# EAGLE design i2c_keypad (EAGLE 5.10)
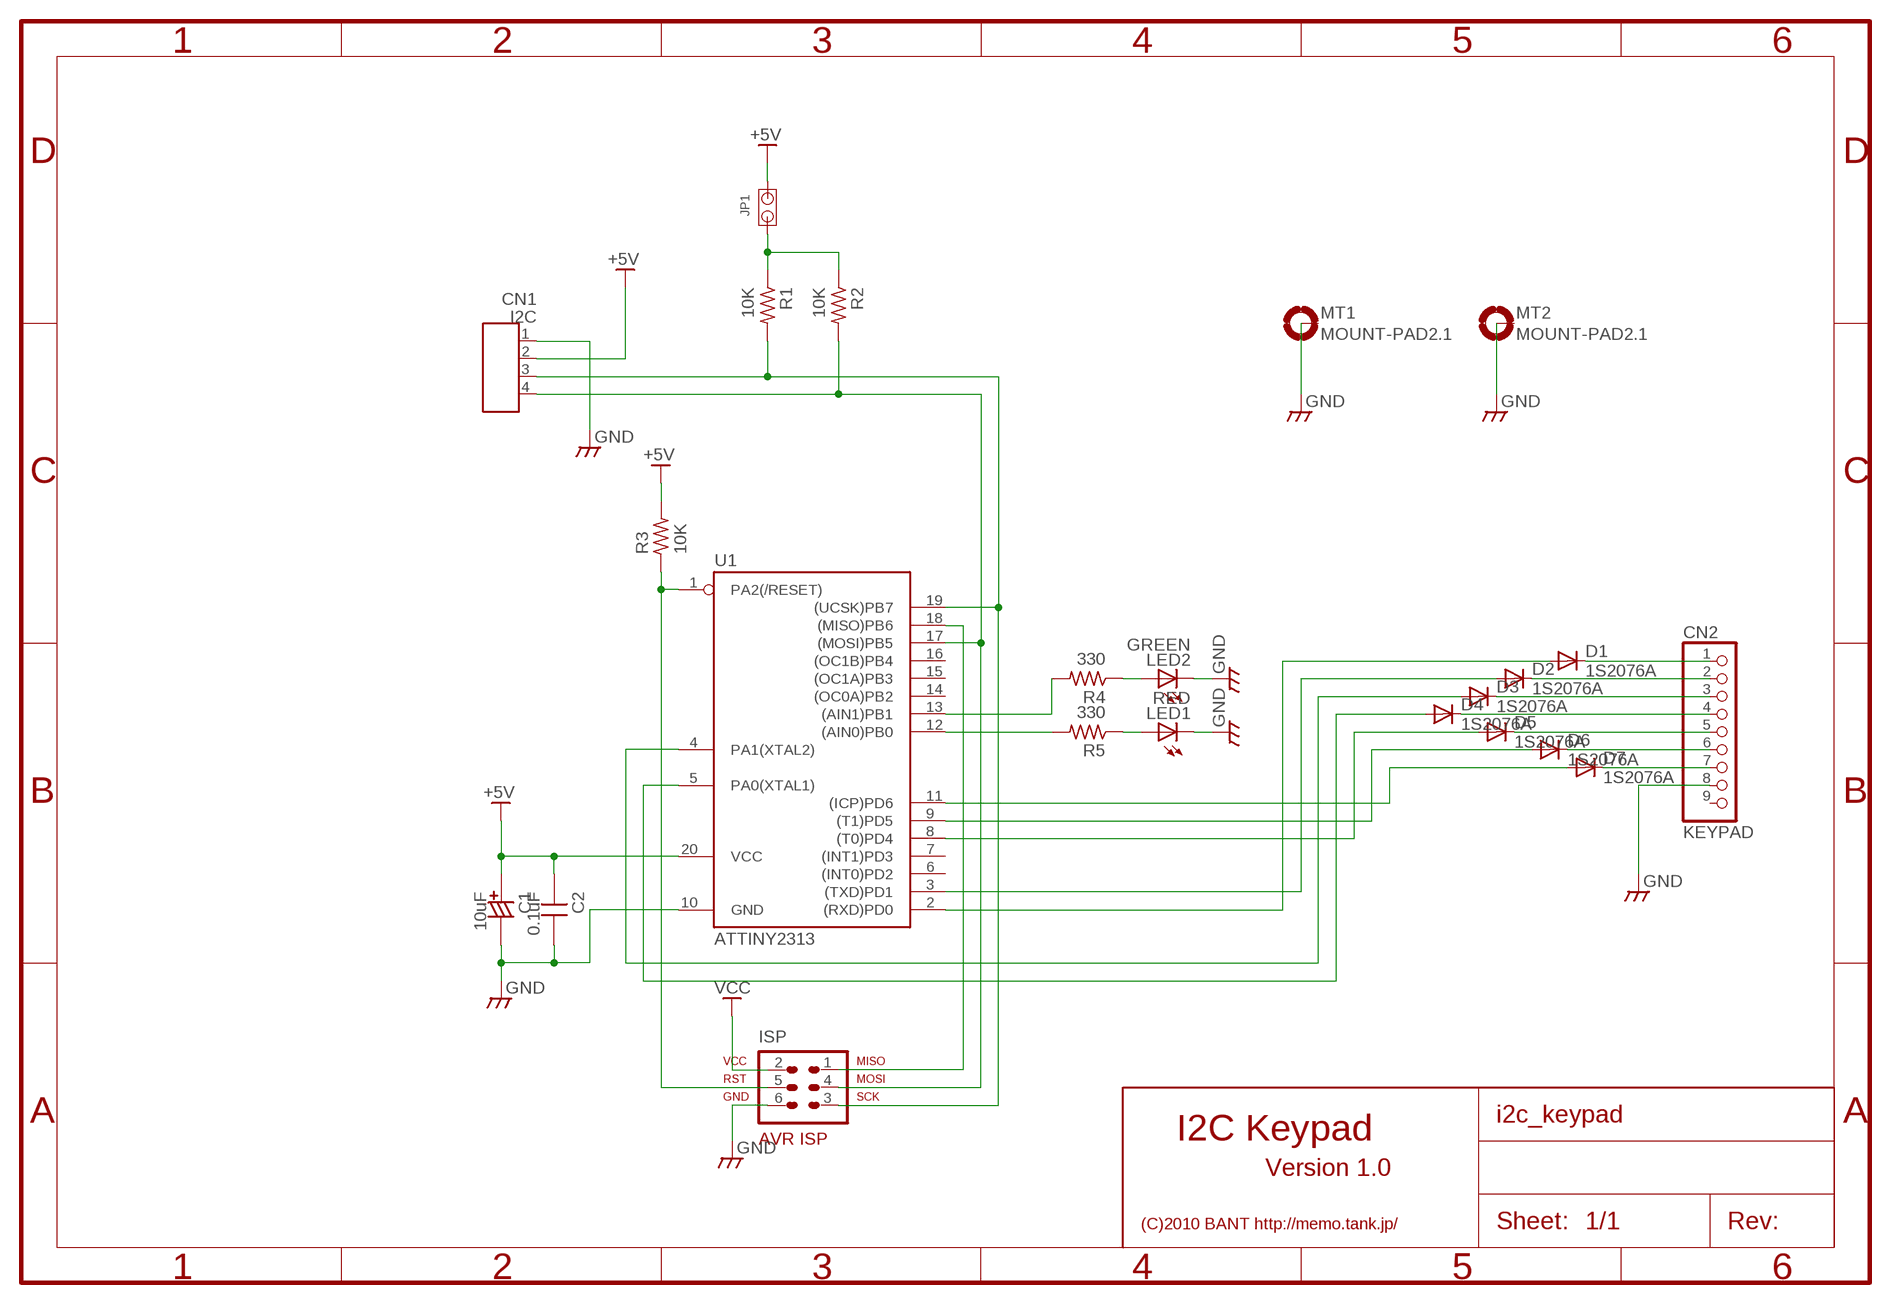
[diagram p0: schematic, sheet 1]

## Parts
C1  10uF  CCAP_4  [CCAP_4]
C2  0.1uF  CAPDIP_2  [CAP_DIP_2]
CN1  I2C  CON_4P  [CON_HRS_DIP_4]
CN2  KEYPAD  PINHD-1X09_2.54  [1X09]
D1  1S2076A  AA112  [DO07]
D2  1S2076A  AA112  [DO07]
D3  1S2076A  AA112  [DO07]
D4  1S2076A  AA112  [DO07]
D5  1S2076A  AA112  [DO07]
D6  1S2076A  AA112  [DO07]
D7  1S2076A  AA112  [DO07]
ISP  AVR-ISP-6NS  [2X3-NS]
JP1  JUMPER_2P  [CON_PINHEAD_2]
LED1  RED  LED3MM  [LED3MM]
LED2  GREEN  LED3MM  [LED3MM]
MT1  MOUNT-PAD2.1  [PAD-2.1]
MT2  MOUNT-PAD2.1  [PAD-2.1]
R1  10K  R0.125W_3P  [R_0.125W_3]
R2  10K  R0.125W_3P  [R_0.125W_3]
R3  10K  R0.125W_3P  [R_0.125W_3]
R4  330  R0.125W_3P  [R_0.125W_3]
R5  330  R0.125W_3P  [R_0.125W_3]
U1  ATTINY2313  TINY2313-*P*  [DIL20]

## Nets
GND: C1.- C2.2 CN1.1 CN2.8 ISP.6 LED1.K(C) LED2.K(C) MT1.B2,1(MOUNT) MT2.B2,1(MOUNT) U1.10(GND)
N$1: D1.A U1.2((RXD)PD0)
N$2: D2.A U1.3((TXD)PD1)
N$3: D3.A U1.4(PA1(XTAL2))
N$4: D4.A U1.5(PA0(XTAL1))
N$5: D5.A U1.8((T0)PD4)
N$6: D6.A U1.9((T1)PD5)
N$7: D7.A U1.11((ICP)PD6)
N$8: CN2.1 D1.C
N$9: CN2.2 D2.C
N$10: CN2.3 D3.C
N$11: CN2.4 D4.C
N$12: CN2.5 D5.C
N$13: CN2.6 D6.C
N$14: CN2.7 D7.C
N$15: CN1.4 ISP.4 R2.2 U1.17((MOSI)PB5)
N$16: ISP.5 R3.1 U1.1(PA2(/RESET))
N$17: R4.2 U1.13((AIN1)PB1)
N$18: ISP.1 U1.18((MISO)PB6)
N$19: R5.2 U1.12((AIN0)PB0)
N$20: LED1.A R5.1
N$21: JP1.1 R1.1 R2.1
N$22: LED2.A R4.1
N$23: CN1.3 ISP.3 R1.2 U1.19((UCSK)PB7)
VCC: C1.+ C2.1 CN1.2 ISP.2 JP1.2 R3.2 U1.20(VCC) ; supply symbol labelled +5V
Unconnected: CN2.9 U1.6((INT0)PD2) U1.7((INT1)PD3) U1.14((OC0A)PB2) U1.15((OC1A)PB3) U1.16((OC1B)PB4)

## Notes on the sheet
- I2C Keypad
- Version 1.0
- (C)2010 BANT http://memo.tank.jp/

## Library data of the parts
C1 = MyLib:CCAP: Polar capacitor
C2 = MyLib:CAP: Non polar capacitor
CN1 = MyLib:CON_4P: 4P Molex Connector
CN2 = pinheader:PINHD-1X09: PIN HEADER
D1-D7 = diode:AA112: DIODE germanium
ISP = atmel:AVR-ISP-6: AVR ISP-6 Serial Programming Header
JP1 = MyLib:JUMPER_2P: 2P Jumper Switch
LED1 LED2 = led:LED: LED OSRAM: - CHIPLED LG R971, LG N971, LY N971, LG Q971, LY Q971, LO R971, LY R971 LH N974, LH R974 LS Q976, LO Q976, LY Q976 LO Q996 - Hyper CHIPLED LW Q18S LB Q993, LB Q99A, LB R99A - SideLED LS A670, LO A670, LY A670, LG A670, LP A670 LB A673, LV A673, LT A673, LW A673 LH A674 LY A675 LS A676, LA A676, LO A676, LY A676, LW A676 LS A679, LY A679, LG A679 - Hyper Micro SIDELEDR LS Y876, LA Y876, LO Y876, LY Y876 LT Y87S - SmartLED LW L88C, LW L88S LB L89C, LB L89S, LG L890 LS L89K, LO L89K, LY L89K LS L896, LA L896, LO L896, LY L896 - TOPLED LS T670, LO T670, LY T670, LG T670, LP T670 LSG T670, LSP T670, LSY T670, LOP T670, LYG T670 LG T671, LOG T671, LSG T671 LB T673, LV T673, LT T673, LW T673 LH T674 LS T676, LA T676, LO T676, LY T676, LB T676, LH T676, LSB T676, LW T676 LB T67C, LV T67C, LT T67C, LS T67K, LO T67K, LY T67K, LW E67C LS E67B, LA E67B, LO E67B, LY E67B, LB E67C, LV E67C, LT E67C LW T67C LS T679, LY T679, LG T679 LS T770, LO T770, LY T770, LG T770, LP T770 LB T773, LV T773, LT T773, LW T773 LH T774 LS E675, LA E675, LY E675, LS T675 LS T776, LA T776, LO T776, LY T776, LB T776 LHGB T686 LT T68C, LB T68C - Hyper Mini TOPLEDR LB M676 - Mini TOPLED SantanaR LG M470 LS M47K, LO M47K, LY M47K Source: http://www.osram.convergy.de LUXEON: - LUMILEDR LXK2-PW12-R00, LXK2-PW12-S00, LXK2-PW14-U00, LXK2-PW14-V00 LXK2-PM12-R00, LXK2-PM12-S00, LXK2-PM14-U00 LXK2-PE12-Q00, LXK2-PE12-R00, LXK2-PE12-S00, LXK2-PE14-T00, LXK2-PE14-U00 LXK2-PB12-K00, LXK2-PB12-L00, LXK2-PB12-M00, LXK2-PB14-N00, LXK2-PB14-P00, LXK2-PB14-Q00 LXK2-PR12-L00, LXK2-PR12-M00, LXK2-PR14-Q00, LXK2-PR14-R00 LXK2-PD12-Q00, LXK2-PD12-R00, LXK2-PD12-S00 LXK2-PH12-R00, LXK2-PH12-S00 LXK2-PL12-P00, LXK2-PL12-Q00, LXK2-PL12-R00 Source: www.luxeon.com KINGBRIGHT: KA-3528ASYC Source: www.kingbright.com
MT1 MT2 = MyLib:MOUNT-PAD: 2.1mm Mount Pad (Connectable to GND)
R1-R5 = MyLib:R: General Resiter 1/8W 1/4W 1/2W V/H
U1 = atmel:TINY2313*: Atmel Tiny2313 2K Flash, 128 bytes EEPROM, 128 bytes RAM

## Board
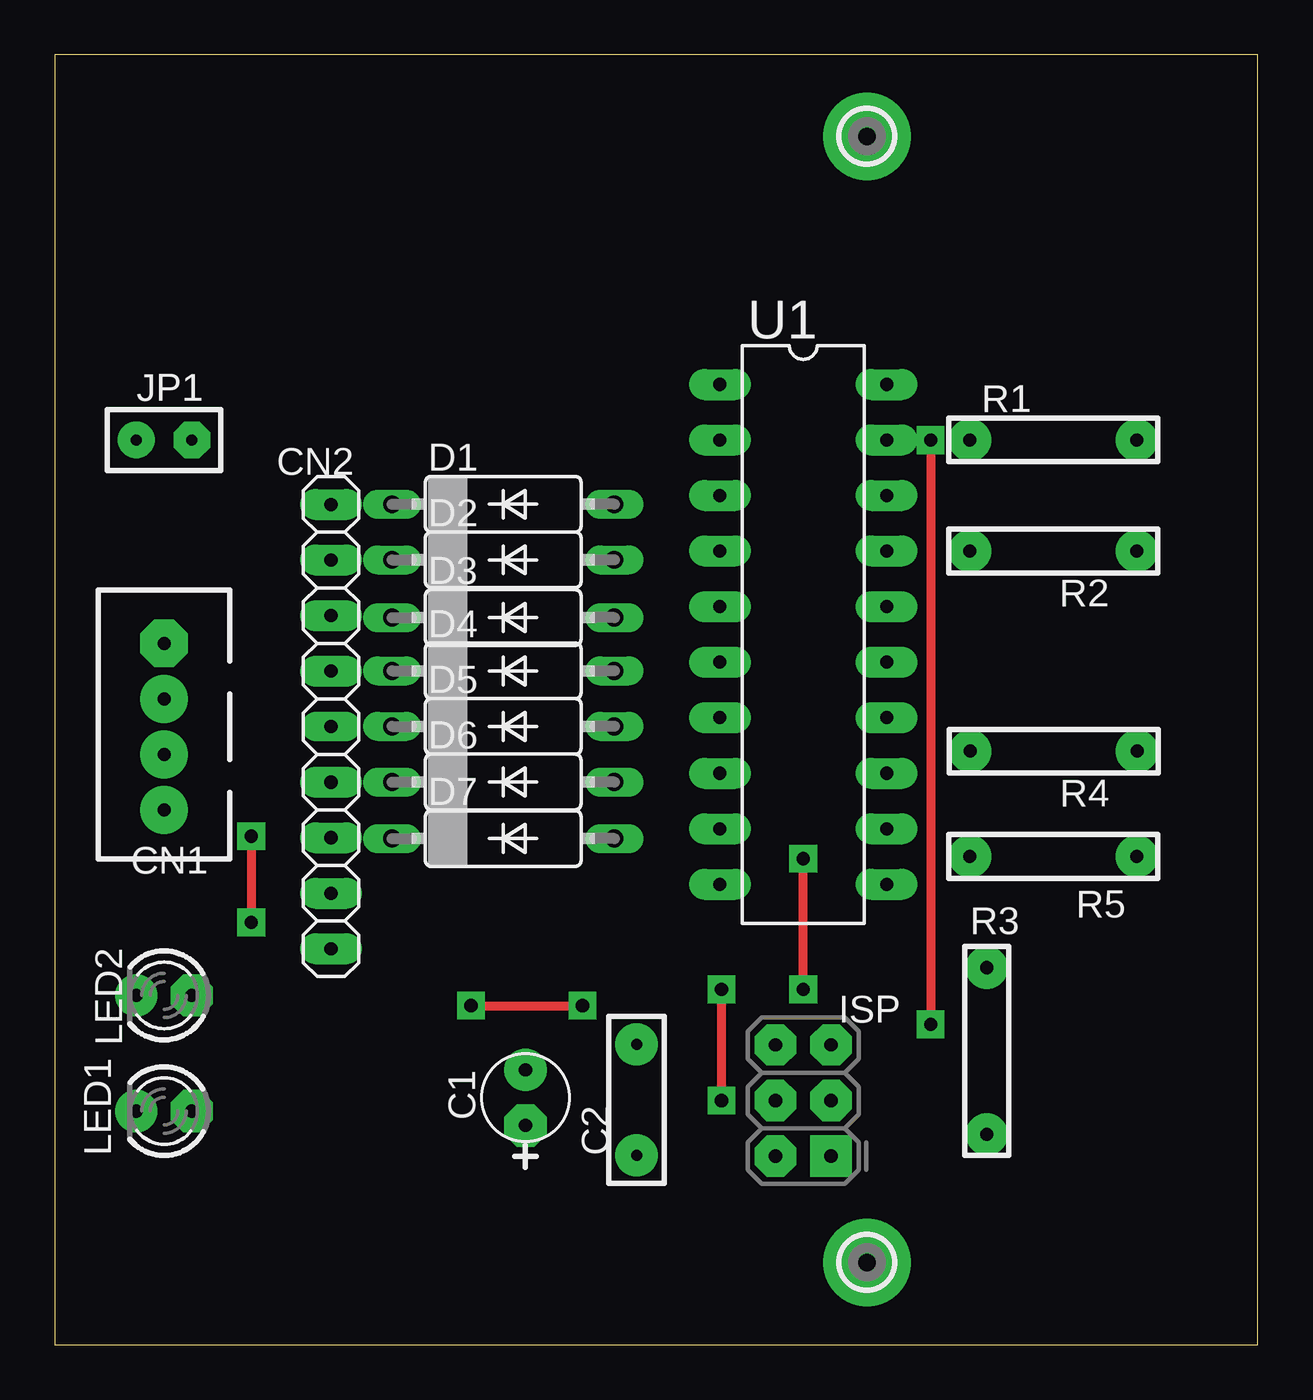
[diagram p1: board, top side]
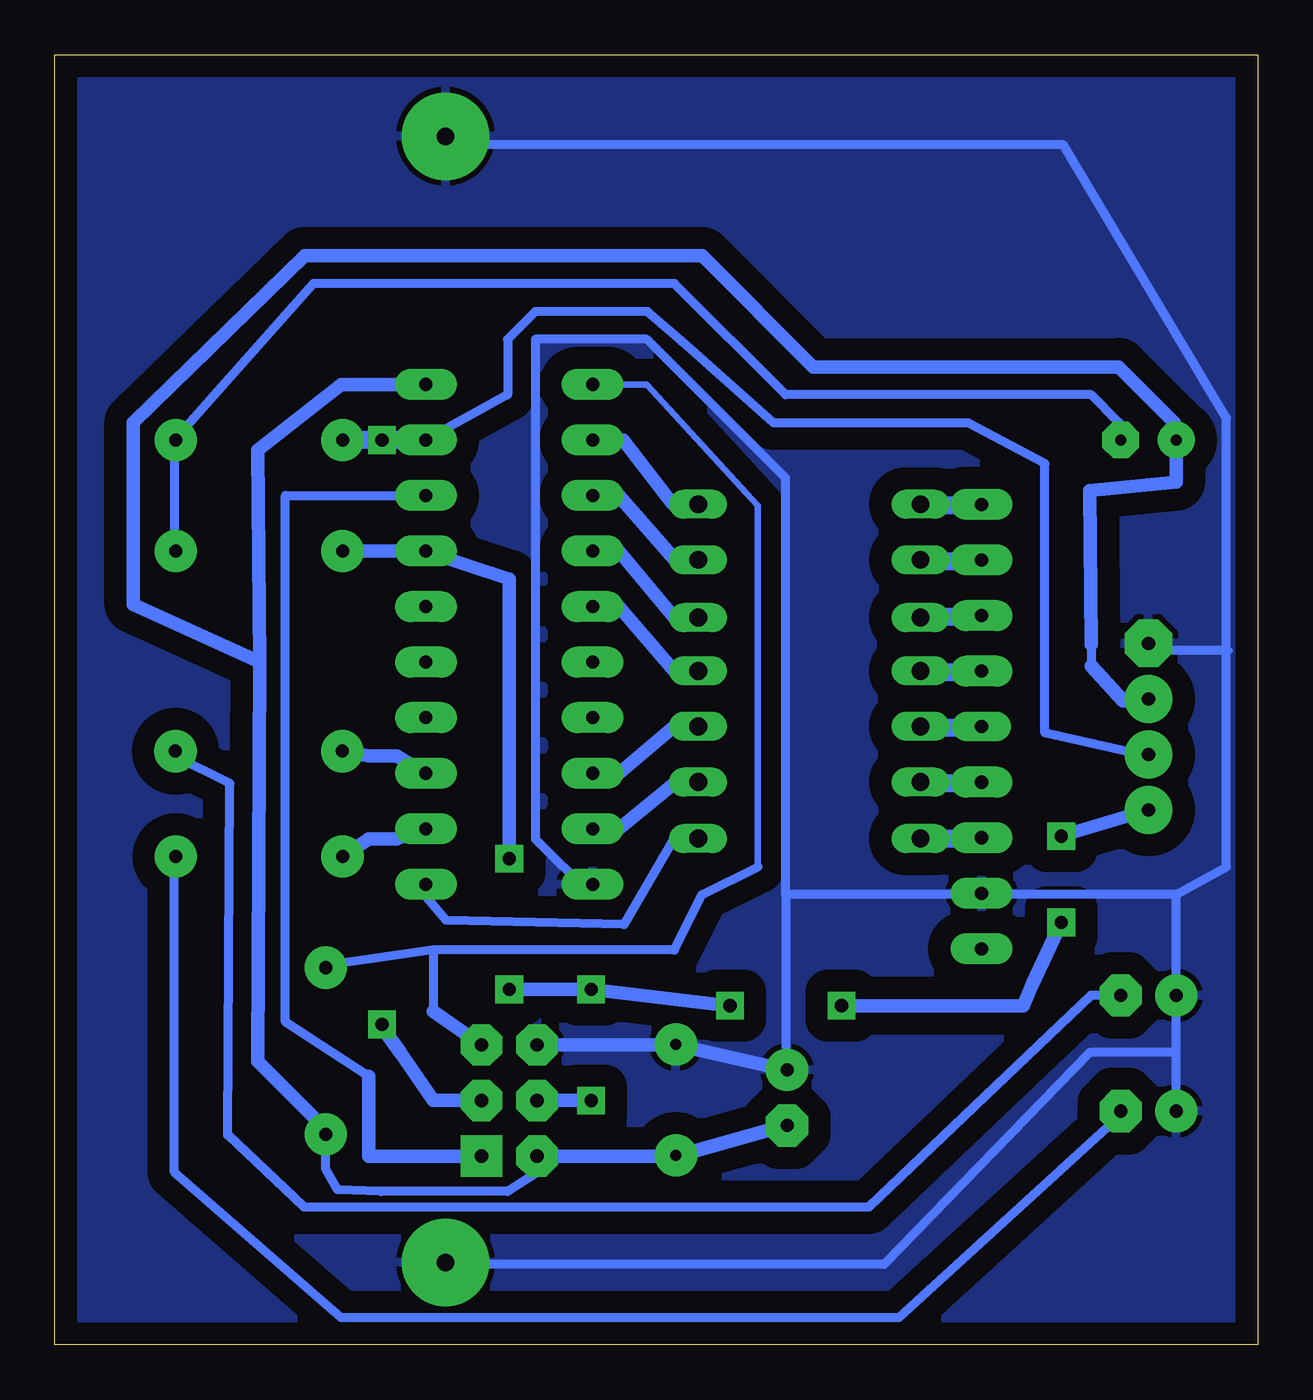
[diagram p2: board, bottom side, seen from below]

Size 55 x 59 mm. Coordinates in mm from the lower left corner, seen from the top.
Outline: 0,0 55,0 55,59 0,59 0,0
Copper layers (1*16): Top 0.035mm / dielectric 1.5mm / Bottom 0.035mm
Design rules "default": minimum track width 10mil, minimum drill 24mil, track to track 8mil, track to pad 8mil, pad to pad 8mil, via to via 8mil, smd to smd 8mil, copper to edge 40mil, drill to drill 8mil, minimum pad ring 10mil, minimum via ring 8mil, stop-mask expansion 4mil, vias tented up to drill 0mil, thermal gap 10mil

### Footprints (pad centres in the part's own frame; a part is rotated, then mirrored left to right if it is on the bottom)
CCAP_4 = drill 0.6 pad 1.93 octagon: + -1.27,0 | drill 0.6 pad 1.93 round: - 1.27,0
CAP_DIP_2 = drill 0.5 pad 1.93 round: 1 -2.54,0; 2 2.54,0
CON_HRS_DIP_4 = drill 0.6 pad 2.184 octagon: 1 -3.81,0 | drill 0.6 pad 2.184 round: 2 -1.27,0; 3 1.27,0; 4 3.81,0
1X09 = drill 0.6 pad 1.422 long: 1 -10.16,0; 2 -7.62,0; 3 -5.08,0; 4 -2.54,0; 6 2.54,0; 7 5.08,0; 8 7.62,0; 9 10.16,0 | drill 0.6 pad 1.346 long: 5 0,0
DO07 = drill 0.813 long: A 5.08,0; C -5.08,0
2X3-NS = drill 0.6 pad 1.88 square: 1 -2.54,-1.27 | drill 0.6 pad 1.88 octagon: 2 -2.54,1.27; 3 0,-1.27; 4 0,1.27; 5 2.54,-1.27; 6 2.54,1.27
CON_PINHEAD_2 = drill 0.5 pad 1.676 octagon: 1 -1.27,0 | drill 0.5 pad 1.676 round: 2 1.27,0
LED3MM = drill 0.6 pad 1.93 octagon: A -1.27,0 | drill 0.6 pad 1.93 round: K 1.27,0
PAD-2.1 = drill 0.8 pad 4 round: B2,1 0,0
R_0.125W_3 = drill 0.6 pad 1.93 round: 1 -3.81,0; 2 3.81,0
DIL20 = drill 0.6 pad 1.422 long: 1 -11.43,-3.81; 2 -8.89,-3.81; 3 -6.35,-3.81; 4 -3.81,-3.81; 5 -1.27,-3.81; 6 1.27,-3.81; 7 3.81,-3.81; 8 6.35,-3.81; 9 8.89,-3.81; 10 11.43,-3.81; 11 11.43,3.81; 12 8.89,3.81; 13 6.35,3.81; 14 3.81,3.81; 15 1.27,3.81; 16 -1.27,3.81; 17 -3.81,3.81; 18 -6.35,3.81; 19 -8.89,3.81; 20 -11.43,3.81

### Placement (x,y rotation side)
C1  21.52,11.3 90 top
C2  26.6,11.2 90 top
CN1  5,28.27 270 top
CN2  12.63,28.27 270 top
D1  20.5,38.44 0 top
D2  20.5,35.9 0 top
D3  20.5,33.26 0 top
D4  20.5,30.82 0 top
D5  20.5,28.28 0 top
D6  20.5,25.74 0 top
D7  20.5,23.15 0 top
ISP  34.22,11.17 90 top
JP1  5,41.38 180 top
LED1  5,10.69 180 top
LED2  5,15.98 180 top
MT1  37.13,55.27 0 top
MT2  37.13,3.77 0 top
R1  45.65,41.38 180 top
R2  45.65,36.3 180 top
R3  42.61,13.44 270 top
R4  45.67,27.15 180 top
R5  45.65,22.33 180 top
U1  34.22,32.49 270 top

### Tracks (layer width: path | path; a pad name or v marks a point on that pad's centre or on a via)
GND
  Bottom 0.254: LED1.K 3.73,10.43 | 12.7,20.59 CN2.8 | 1.44,31.75 1.27,31.75
  Bottom 0.406: 3.73,10.43 3.73,13.37 | 3.73,13.37 LED2.K 3.73,20.59 | 3.73,20.59 1.44,21.86 1.44,31.75 | ISP.6 33.02,13.71 | 21.59,20.59 21.59,12.57 C1.- | 21.59,20.59 21.59,39.64 27.94,45.99 33.02,45.99 33.02,23.13 30.48,20.59 U1.10 | 21.59,20.59 12.7,20.59 3.73,20.59 | 26.6,13.71 C2.2 | MT2.B2,1 36.13,3.68 17.08,3.68 7.69,13.37 3.73,13.37 | 1.44,31.75 1.44,42.38 8.89,54.88 37.13,54.88 MT1.B2,1 | 1.44,31.75 5.08,31.75 CN1.1
  Bottom 0.61: ISP.6 26.6,13.71 21.59,12.57
  pour Bottom (isolate 1.016): 0,59 0,0 55,0 55,59
N$1
  Bottom 0.61: D1.A 26.77,38.47 29.01,41.38 U1.2
N$2
  Bottom 0.61: D2.A 26.67,35.93 29.21,38.84 U1.3
N$3
  Bottom 0.61: D3.A 26.67,33.26 29.21,36.3 U1.4
N$4
  Bottom 0.61: D4.A 26.67,30.82 29.21,33.76 U1.5
N$5
  Bottom 0.61: D5.A 26.67,28.28 29.21,26.14 U1.8
N$6
  Bottom 0.61: D6.A 26.67,25.67 29.21,23.6 U1.9
N$7
  Bottom 0.406: D7.A 26.67,23.15 28.97,19.22 37.1,19.42 38.1,20.59 U1.11
N$8
  Bottom 0.254: 15.24,38.37 D1.C | CN2.1 12.7,38.37
  Bottom 0.813: 12.7,38.37 15.24,38.37
N$9
  Bottom 0.254: 15.24,35.83 D2.C | CN2.2 12.7,35.83
  Bottom 0.813: 12.7,35.83 15.24,35.83
N$10
  Bottom 0.254: 15.24,33.29 D3.C | CN2.3 12.7,33.29
  Bottom 0.813: 12.7,33.29 15.24,33.29
N$11
  Bottom 0.254: 15.24,30.75 D4.C | CN2.4 12.7,30.75
  Bottom 0.813: 12.7,30.75 15.24,30.75
N$12
  Bottom 0.254: 15.24,28.21 D5.C | CN2.5 12.7,28.21
  Bottom 0.813: 12.7,28.21 15.24,28.21
N$13
  Bottom 0.254: 15.24,25.67 D6.C | CN2.6 12.7,25.67
  Bottom 0.813: 12.7,25.67 15.24,25.67
N$14
  Bottom 0.254: 15.24,23.13 D7.C | CN2.7 12.7,23.13
  Bottom 0.813: 12.7,23.13 15.24,23.13
N$15  (via drill 0.6 pad 1.27)
  Top 0.406: v34.21,16.26 v34.21,22.23 | v8.99,23.26 v8.99,19.32 | v19.03,15.51 v24.13,15.51 | v30.48,16.26 v30.48,11.17
  Bottom 0.254: 38.1,36.3 U1.17 | R2.2 41.91,36.3 | ISP.4 33.02,11.17
  Bottom 0.61: R2.2 38.1,36.3 34.21,35.03 v34.21,22.23 | CN1.4 v8.99,23.26 | v8.99,19.32 10.31,16.48 10.73,15.51 v19.03,15.51 | v24.13,15.51 v30.48,16.26 v34.21,16.26 | v30.48,11.17 ISP.4
N$16
  Bottom 0.254: 42.58,17.35 R3.1
  Bottom 0.305: 22.86,21.86 22.86,38.37 27.94,43.92 U1.1
  Bottom 0.406: 22.86,21.86 25.4,20.59 26.67,18.05 37.7,18.05 | 37.7,18.05 37.7,15.24 | 37.7,18.05 42.58,17.35
  Bottom 0.61: 37.7,15.24 ISP.5
N$17
  Bottom 0.61: U1.13 39.37,26.94 40.64,26.94 R4.2
N$18
  Bottom 0.406: U1.18 44.45,38.84 44.45,14.77 40.64,12.27
  Bottom 0.61: 40.64,12.27 40.64,8.63 ISP.1
N$19
  Bottom 0.61: U1.12 39.37,23.13 40.64,23.13 R5.2
N$20
  Bottom 0.254: 6.35,10.69 LED1.A 6.35,10.43 | 49.53,21.86 R5.1
  Bottom 0.406: 49.53,21.86 49.53,7.89 41.91,1.24 16.41,1.24 6.35,10.43
N$21
  Bottom 0.254: R1.1 49.53,40.91
  Bottom 0.406: R1.1 49.53,41.38 43.18,48.53 26.67,48.53 21.59,43.45 7.62,43.45 6.35,42.18 JP1.1 | 49.53,40.91 49.53,37.1 R2.1
N$22
  Bottom 0.406: LED2.A 7.62,15.98 17.78,6.3 43.6,6.3 47.09,9.6 46.99,25.67 49.53,26.94 R4.1
N$23  (via drill 0.6 pad 1.27)
  Top 0.406: v40.04,41.38 v40.04,14.66
  Bottom 0.254: CN1.3 5.08,26.94 | R1.2 41.91,41.38
  Bottom 0.406: 5.08,26.94 9.73,27.99 9.73,40.29 13.23,42.16 22.13,42.16 26.34,45.89 27.91,47.26 33.02,47.26 34.29,45.99 34.29,43.45 U1.19 | v40.04,14.66 40.14,14.67
  Bottom 0.61: ISP.3 37.7,11.17 39.2,13.37 40.14,14.67
  Bottom 0.813: R1.2 v40.04,41.38 U1.19
VCC
  Bottom 0.254: 26.6,8.63 C2.1 | 5.08,29.48 CN1.2 | 27.94,49.8
  Bottom 0.406: C1.+ 21.59,10.03 | 7.62,32.02 7.62,31.05 | 43.18,10.43 R3.2 42.61,8.06 42.06,7.09 40.09,7.02 34.29,7.02 32.95,7.89 ISP.2
  Bottom 0.61: ISP.2 26.6,8.63 21.59,10.03 | 7.62,32.02 7.68,39.06 3.73,39.46 JP1.2 3.81,42.18 6.35,44.72 20.32,44.72 25.4,49.8 27.94,49.8 | 7.62,31.05 6.15,29.45 5.08,29.48 | 45.62,31.22 45.72,12.97 43.18,10.43 | 45.62,31.22 45.72,40.91 41.91,43.92 U1.20 | 27.94,49.8 43.58,49.8 51.4,42.18 51.4,33.86 45.62,31.22